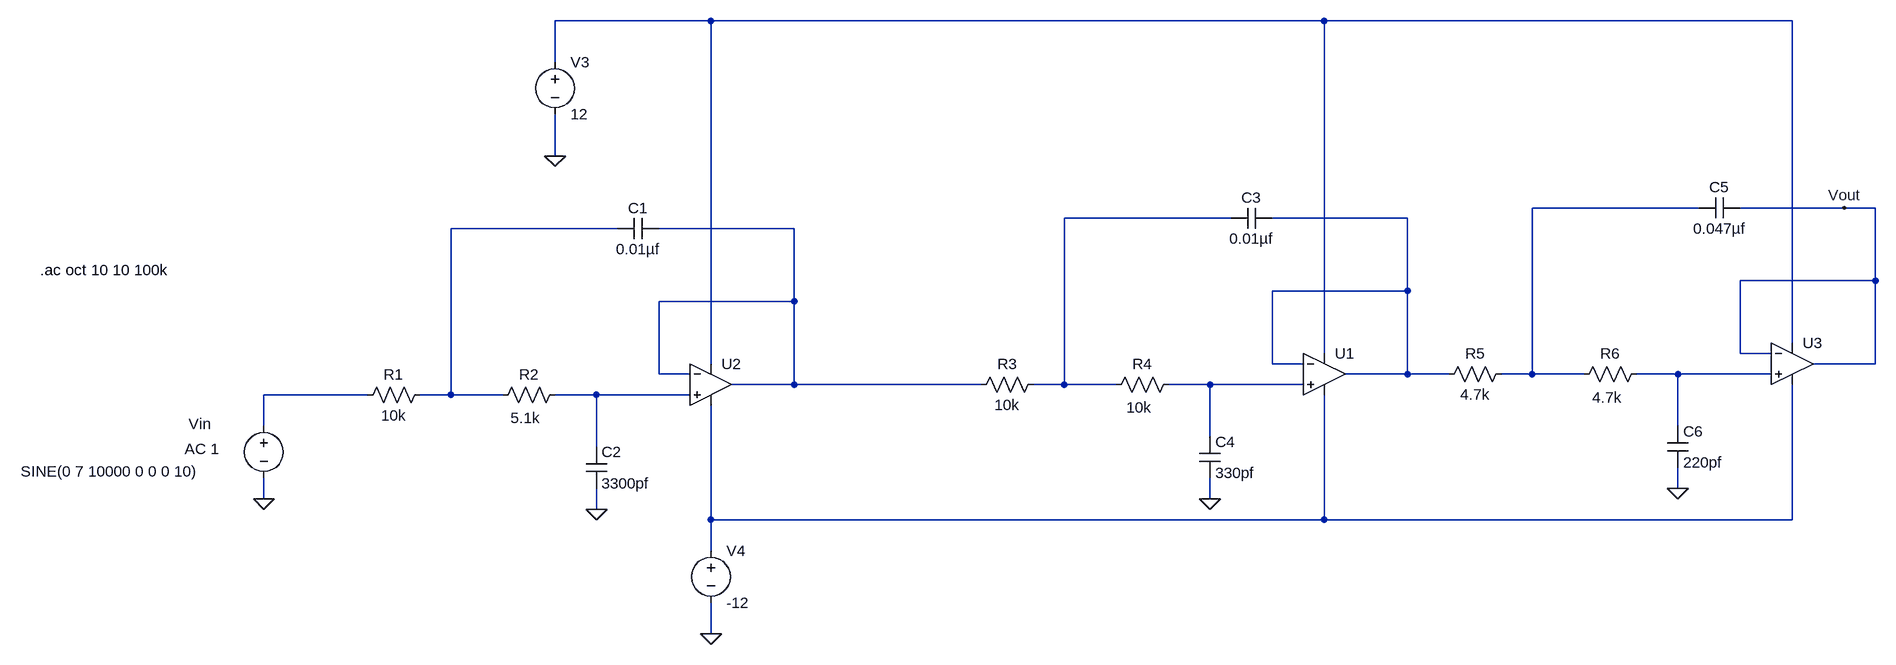
[diagram p0: schematic MV_AA_Filter.asc]
MV_AA_Filter.asc, the LTspice schematic file:
Version 4
SHEET 1 2072 680
WIRE 272 -368 32 -368
WIRE 1216 -368 272 -368
WIRE 1936 -368 1216 -368
WIRE 32 -304 32 -368
WIRE 32 -160 32 -224
WIRE 1792 -80 1536 -80
WIRE 2016 -80 1856 -80
WIRE 2064 -80 2016 -80
WIRE 1072 -64 816 -64
WIRE 1344 -64 1136 -64
WIRE 128 -48 -128 -48
WIRE 400 -48 192 -48
WIRE 2064 32 2064 -80
WIRE 2064 32 1856 32
WIRE 1344 48 1344 -64
WIRE 1344 48 1136 48
WIRE 400 64 400 -48
WIRE 400 64 192 64
WIRE 1936 128 1936 -368
WIRE 1216 144 1216 -368
WIRE 1856 144 1856 32
WIRE 1904 144 1856 144
WIRE 272 160 272 -368
WIRE 1136 160 1136 48
WIRE 1184 160 1136 160
WIRE 2064 160 2064 32
WIRE 2064 160 1968 160
WIRE 192 176 192 64
WIRE 240 176 192 176
WIRE 1344 176 1344 48
WIRE 1344 176 1248 176
WIRE 1408 176 1344 176
WIRE 1536 176 1536 -80
WIRE 1536 176 1488 176
WIRE 1616 176 1536 176
WIRE 1760 176 1696 176
WIRE 1904 176 1760 176
WIRE 400 192 400 64
WIRE 400 192 304 192
WIRE 688 192 400 192
WIRE 816 192 816 -64
WIRE 816 192 768 192
WIRE 896 192 816 192
WIRE 1040 192 976 192
WIRE 1184 192 1040 192
WIRE -256 208 -416 208
WIRE -128 208 -128 -48
WIRE -128 208 -176 208
WIRE -48 208 -128 208
WIRE 96 208 32 208
WIRE 240 208 96 208
WIRE -416 256 -416 208
WIRE 1760 256 1760 176
WIRE 1040 272 1040 192
WIRE 96 288 96 208
WIRE 1760 352 1760 320
WIRE -416 368 -416 336
WIRE 1040 368 1040 336
WIRE 96 384 96 352
WIRE 272 400 272 224
WIRE 1216 400 1216 208
WIRE 1216 400 272 400
WIRE 1936 400 1936 192
WIRE 1936 400 1216 400
WIRE 272 448 272 400
WIRE 272 576 272 528
FLAG 96 384 0
FLAG -416 368 0
FLAG 2016 -80 Vout
FLAG 32 -160 0
FLAG 272 576 0
FLAG 1040 368 0
FLAG 1760 352 0
SYMBOL res -160 192 R90
WINDOW 0 0 56 VBottom 2
WINDOW 3 32 56 VTop 2
SYMATTR InstName R1
SYMATTR Value 10k
SYMBOL voltage -416 240 R0
WINDOW 3 -374 86 Left 2
WINDOW 123 -122 51 Left 2
WINDOW 39 0 0 Left 2
WINDOW 0 -116 13 Left 2
SYMATTR Value SINE(0 7 10000 0 0 0 10)
SYMATTR Value2 AC 1
SYMATTR InstName Vin
SYMBOL Opamps\\UniversalOpamp2 272 192 R0
SYMATTR InstName U2
SYMBOL voltage 32 -320 R0
WINDOW 123 0 0 Left 2
WINDOW 39 0 0 Left 2
SYMATTR InstName V3
SYMATTR Value 12
SYMBOL voltage 272 432 R0
WINDOW 123 0 0 Left 2
WINDOW 39 0 0 Left 2
SYMATTR InstName V4
SYMATTR Value -12
SYMBOL cap 128 -32 R270
WINDOW 0 32 32 VTop 2
WINDOW 3 0 32 VBottom 2
SYMATTR InstName C1
SYMATTR Value 0.01µf
SYMBOL cap 80 288 R0
SYMATTR InstName C2
SYMATTR Value 3300pf
SYMBOL res 48 192 R90
WINDOW 0 0 56 VBottom 2
WINDOW 3 36 61 VTop 2
SYMATTR InstName R2
SYMATTR Value 5.1k
SYMBOL res 784 176 R90
WINDOW 0 0 56 VBottom 2
WINDOW 3 32 56 VTop 2
SYMATTR InstName R3
SYMATTR Value 10k
SYMBOL Opamps\\UniversalOpamp2 1216 176 R0
SYMATTR InstName U1
SYMBOL cap 1072 -48 R270
WINDOW 0 32 32 VTop 2
WINDOW 3 0 32 VBottom 2
SYMATTR InstName C3
SYMATTR Value 0.01µf
SYMBOL cap 1024 272 R0
SYMATTR InstName C4
SYMATTR Value 330pf
SYMBOL res 992 176 R90
WINDOW 0 0 56 VBottom 2
WINDOW 3 36 61 VTop 2
SYMATTR InstName R4
SYMATTR Value 10k
SYMBOL res 1504 160 R90
WINDOW 0 0 56 VBottom 2
WINDOW 3 32 56 VTop 2
SYMATTR InstName R5
SYMATTR Value 4.7k
SYMBOL Opamps\\UniversalOpamp2 1936 160 R0
SYMATTR InstName U3
SYMBOL cap 1792 -64 R270
WINDOW 0 32 32 VTop 2
WINDOW 3 0 32 VBottom 2
SYMATTR InstName C5
SYMATTR Value 0.047µf
SYMBOL cap 1744 256 R0
SYMATTR InstName C6
SYMATTR Value 220pf
SYMBOL res 1712 160 R90
WINDOW 0 0 56 VBottom 2
WINDOW 3 36 61 VTop 2
SYMATTR InstName R6
SYMATTR Value 4.7k
TEXT -760 16 Left 2 !.ac oct 10 10 100k

The netlist it stands for:
* MV_AA_Filter.asc
R1 N005 N009 10k
Vin N009 0 SINE(0 7 10000 0 0 0 10) AC 1
XU2 N010 N006 N001 N011 N006 level.2 Avol=1Meg GBW=10Meg Slew=10Meg ilimit=25m rail=0 Vos=0 phimargin=45 en=0 enk=0 in=0 ink=0 Rin=500Meg  ; pins IN+ IN- V+ V- OUT
V3 N001 0 12
V4 N011 0 -12
C1 N005 N006 0.01µf
C2 N010 0 3300pf
R2 N010 N005 5.1k
R3 N003 N006 10k
XU1 N008 N004 N001 N011 N004 level.2 Avol=1Meg GBW=10Meg Slew=10Meg ilimit=25m rail=0 Vos=0 phimargin=45 en=0 enk=0 in=0 ink=0 Rin=500Meg  ; pins IN+ IN- V+ V- OUT
C3 N003 N004 0.01µf
C4 N008 0 330pf
R4 N008 N003 10k
R5 N002 N004 4.7k
XU3 N007 Vout N001 N011 Vout level.2 Avol=1Meg GBW=10Meg Slew=10Meg ilimit=25m rail=0 Vos=0 phimargin=45 en=0 enk=0 in=0 ink=0 Rin=500Meg  ; pins IN+ IN- V+ V- OUT
C5 N002 Vout 0.047µf
C6 N007 0 220pf
R6 N007 N002 4.7k
.ac oct 10 10 100k
.lib UniversalOpamps2.sub
.backanno
.end